# Altium schematic sheet MCU_ESP32.SchDoc
size A4; SheetNumber: 6; SheetTotal: 7
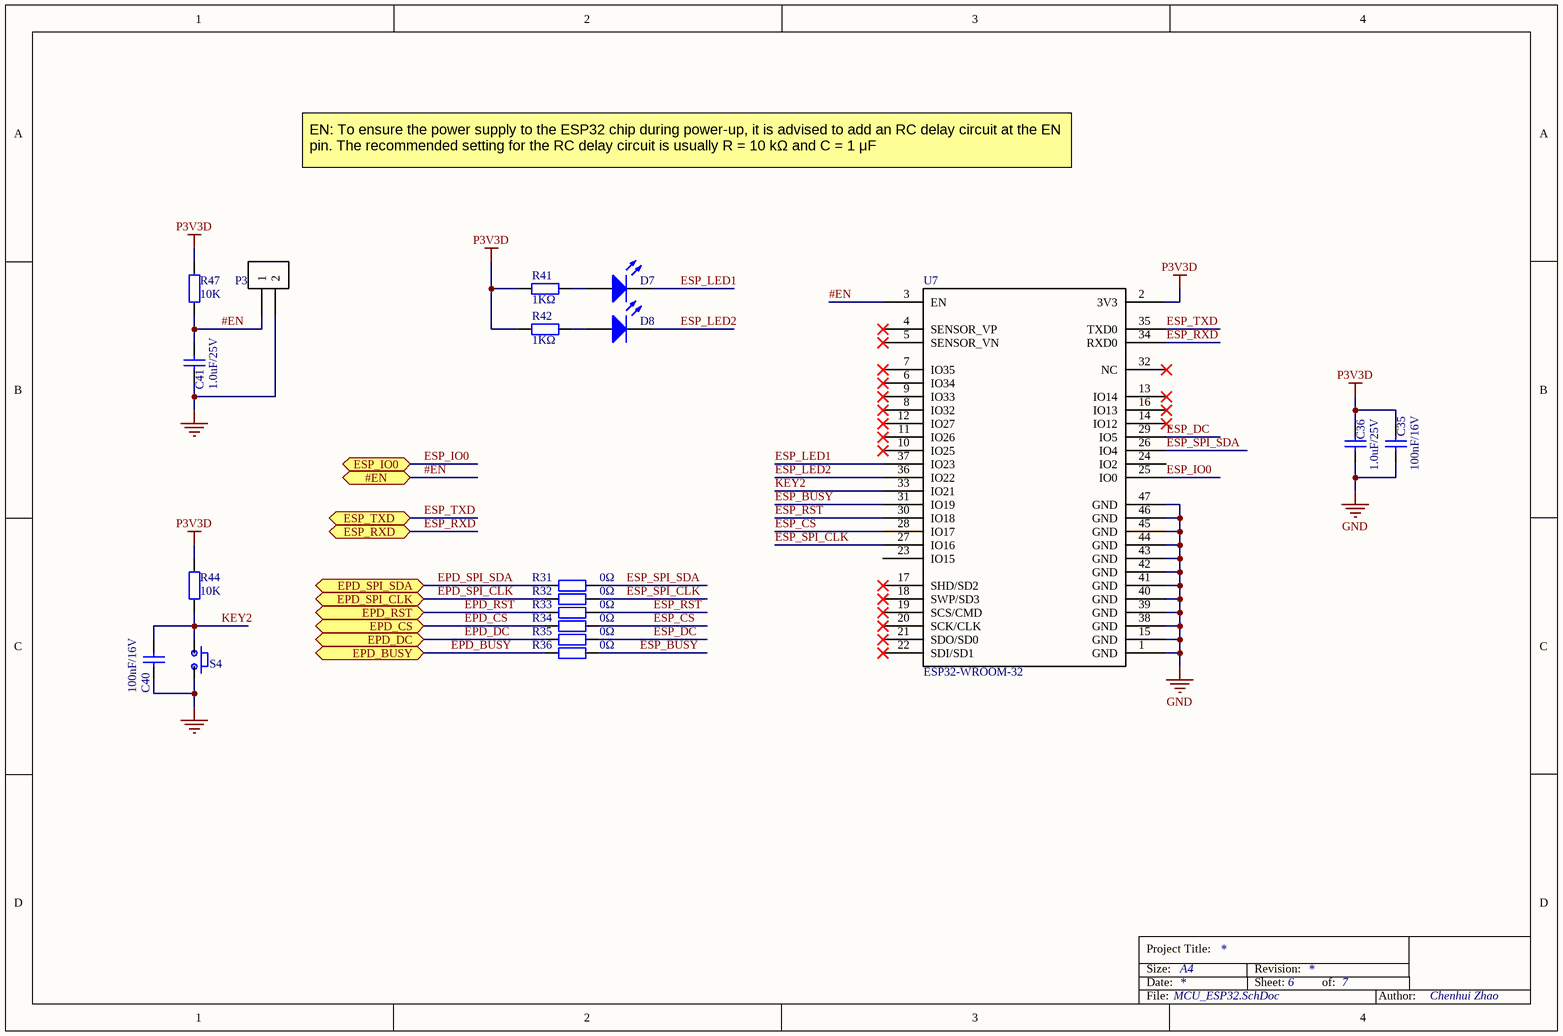
[diagram p0: MCU_ESP32.SchDoc]

## Parts
C35  100nF/16V  [0402_C]
C36  1.0uF/25V  [0402_C]
C40  100nF/16V  [0402_C]
C41  1.0uF/25V  [0402_C]
D7  蓝灯 0603  [0603_LED_S1]  (value not drawn)
D8  蓝灯 0603  [0603_LED_S1]  (value not drawn)
P3  Header 2  [DIP2_2.00]  (value not drawn)
R31  0Ω  [0402_R]
R32  0Ω  [0402_R]
R33  0Ω  [0402_R]
R34  0Ω  [0402_R]
R35  0Ω  [0402_R]
R36  0Ω  [0402_R]
R41  1KΩ  [0402_R]
R42  1KΩ  [0402_R]
R44  10K  [0402_R]
R47  10K  [0402_R]
S4  Button  [SKRKAHE020]  (value not drawn)
U7  ESP32-WROOM-32  [ESP32-WROOM-32]

## Ports
#EN (bidir), EPD_BUSY (bidir), EPD_CS (bidir), EPD_DC (bidir), EPD_RST (bidir), EPD_SPI_CLK (bidir), EPD_SPI_SDA (bidir), ESP_IO0 (bidir), ESP_RXD (bidir), ESP_TXD (bidir)

## Nets
GND: C35.1 C36.1 C40.1 C41.1 P3.2 S4.2 U7.1(GND) U7.15(GND) U7.38(GND) U7.39(GND) U7.40(GND) U7.41(GND) U7.42(GND) U7.43(GND) U7.44(GND) U7.45(GND) U7.46(GND) U7.47(GND)
P3V3D: C35.2 C36.2 R41.2 R42.2 R44.2 R47.2 U7.2(3V3)
#EN: C41.2 P3.1 R47.1 U7.3(EN) ; port #EN
EPD_BUSY: R36.1 ; port EPD_BUSY
EPD_CS: R34.1 ; port EPD_CS
EPD_DC: R35.1 ; port EPD_DC
EPD_RST: R33.1 ; port EPD_RST
EPD_SPI_CLK: R32.1 ; port EPD_SPI_CLK
EPD_SPI_SDA: R31.1 ; port EPD_SPI_SDA
ESP_BUSY: R36.2 U7.31(IO19)
ESP_CS: R34.2 U7.28(IO17)
ESP_DC: R35.2 U7.29(IO5)
ESP_IO0: U7.25(IO0) ; port ESP_IO0
ESP_LED1: D7.K U7.37(IO23)
ESP_LED2: D8.K U7.36(IO22)
ESP_RST: R33.2 U7.30(IO18)
ESP_RXD: U7.34(RXD0) ; port ESP_RXD
ESP_SPI_CLK: R32.2 U7.27(IO16)
ESP_SPI_SDA: R31.2 U7.26(IO4)
ESP_TXD: U7.35(TXD0) ; port ESP_TXD
KEY2: C40.2 R44.1 S4.1 U7.33(IO21)
NetD7_A: D7.A R41.1
NetD8_A: D8.A R42.1

Not connected (* = marked no-connect by the designer): U7 4(SENSOR_VP)* 5(SENSOR_VN)* 6(IO34)* 7(IO35)* 8(IO32)* 9(IO33)* 10(IO25)* 11(IO26)* 12(IO27)* 13(IO14)* 14(IO12)* 16(IO13)* 17(SHD/SD2)* 18(SWP/SD3)* 19(SCS/CMD)* 20(SCK/CLK)* 21(SDO/SD0)* 22(SDI/SD1)* 23(IO15) 24(IO2) 32(NC)*

## Notes on the sheet
- EN: To ensure the power supply to the ESP32 chip during power-up, it is advised to add an RC delay circuit at the EN pin. The recommended setting for the RC delay circuit is usually R = 10 kΩ and C = 1 μF
- Date:
- Size:
- Project Title:
- A4
- Revision:
- Sheet:
- of:
- File:
- Author:
- Chenhui Zhao

## Library data of the parts
C35 C40 = 0402 100nF (104) 10% 16V: 贴片电容; ComponentLink1Description: 供应商链接; ComponentLink1URL: http://www.szlcsc.com/product/details_1877.html; Package: 0402; Supplier: LC; SuppliersPartNumber: C1525
C36 C41 = 0402 1.0uF (105) 10% 25V: 贴片电容; ComponentLink1Description: 供应商链接; ComponentLink1URL: http://www.szlcsc.com/product/details_53938.html; Package: 0402; Supplier: LC; SuppliersPartNumber: C52923
D7 D8 = 0603 蓝灯: 发光二极管; ComponentLink1Description: 供应商链接; ComponentLink1URL: http://www.szlcsc.com/product/details_73150.html; Package: 0603; Supplier: LC; SuppliersPartNumber: C72041
P3 = Header 2: Header, 2-Pin
R31-R36 = 0402 0Ω (0R0) 1%: 贴片电阻; ComponentLink1Description: 供应商链接; ComponentLink1URL: http://www.szlcsc.com/product/details_17853.html; Package: 0402; Supplier: LC; SuppliersPartNumber: C17168
R41 R42 = 0402 1KΩ (1001) 1%: 贴片电阻; ComponentLink1Description: 供应商链接; ComponentLink1URL: http://www.szlcsc.com/product/details_12256.html; Package: 0402; Supplier: LC; SuppliersPartNumber: C11702
R44 R47 = 0402 10KΩ (1002) 1%: 贴片电阻; ComponentLink1Description: 供应商链接; ComponentLink1URL: http://www.szlcsc.com/product/details_26487.html; Package: 0402; Supplier: LC; SuppliersPartNumber: C25744
U7 = ESP32-WROOM-32: ESP32-WROOM-32D and ESP32-WROOM-32U are powerful, generic Wi-Fi+BT+BLE MCU modules that target a wide variety of applications, ranging from low-power sensor networks to the most demanding tasks,; Manufacturer_Part_Number: ESP32-WROOM-32UE (16MB); Vendor: Espressif Systems; Built_By: EMA_Kyle; SourceLibrary: Update_to_database_2021-06-03; Datasheet: https://www.espressif.com/sites/default/files/documentation/esp32-wroom-32e_esp32-wroom-32ue_datasheet_en.pdf; Copyright: Copyright (C) 2018 Accelerated Designs. All rights reserved; RefDes: RefDes; Type: DEV